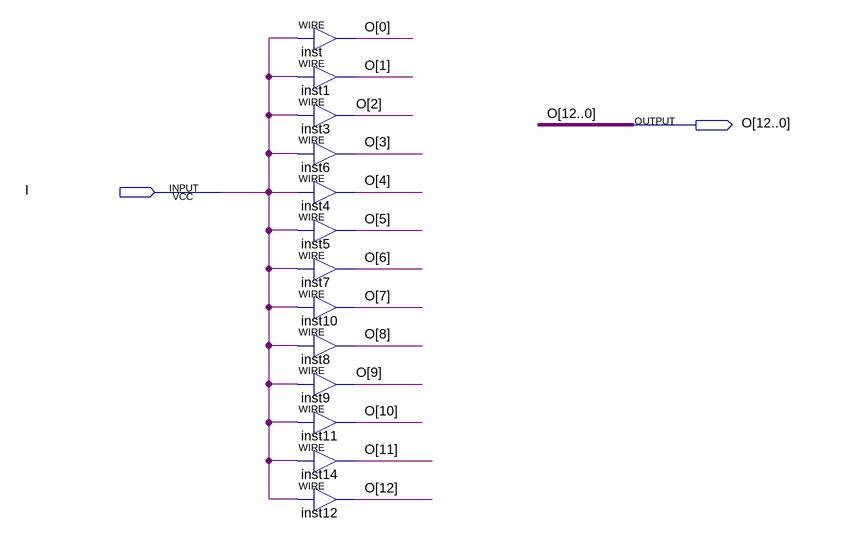
[diagram p0: schematic sheet]
// Quartus schematic Extend13.bdf as structural Verilog: 13 symbols, 2 pins
module Extend13 (
  input  I,
  output [12:0] O
);

  assign O[0] = I;  // WIRE inst
  assign O[1] = I;  // WIRE inst1
  assign O[2] = I;  // WIRE inst3
  assign O[3] = I;  // WIRE inst6
  assign O[4] = I;  // WIRE inst4
  assign O[5] = I;  // WIRE inst5
  assign O[6] = I;  // WIRE inst7
  assign O[7] = I;  // WIRE inst10
  assign O[8] = I;  // WIRE inst8
  assign O[9] = I;  // WIRE inst9
  assign O[10] = I;  // WIRE inst11
  assign O[11] = I;  // WIRE inst14
  assign O[12] = I;  // WIRE inst12
endmodule
